# EAGLE design pico_test_synth1 (EAGLE 9.6.2)
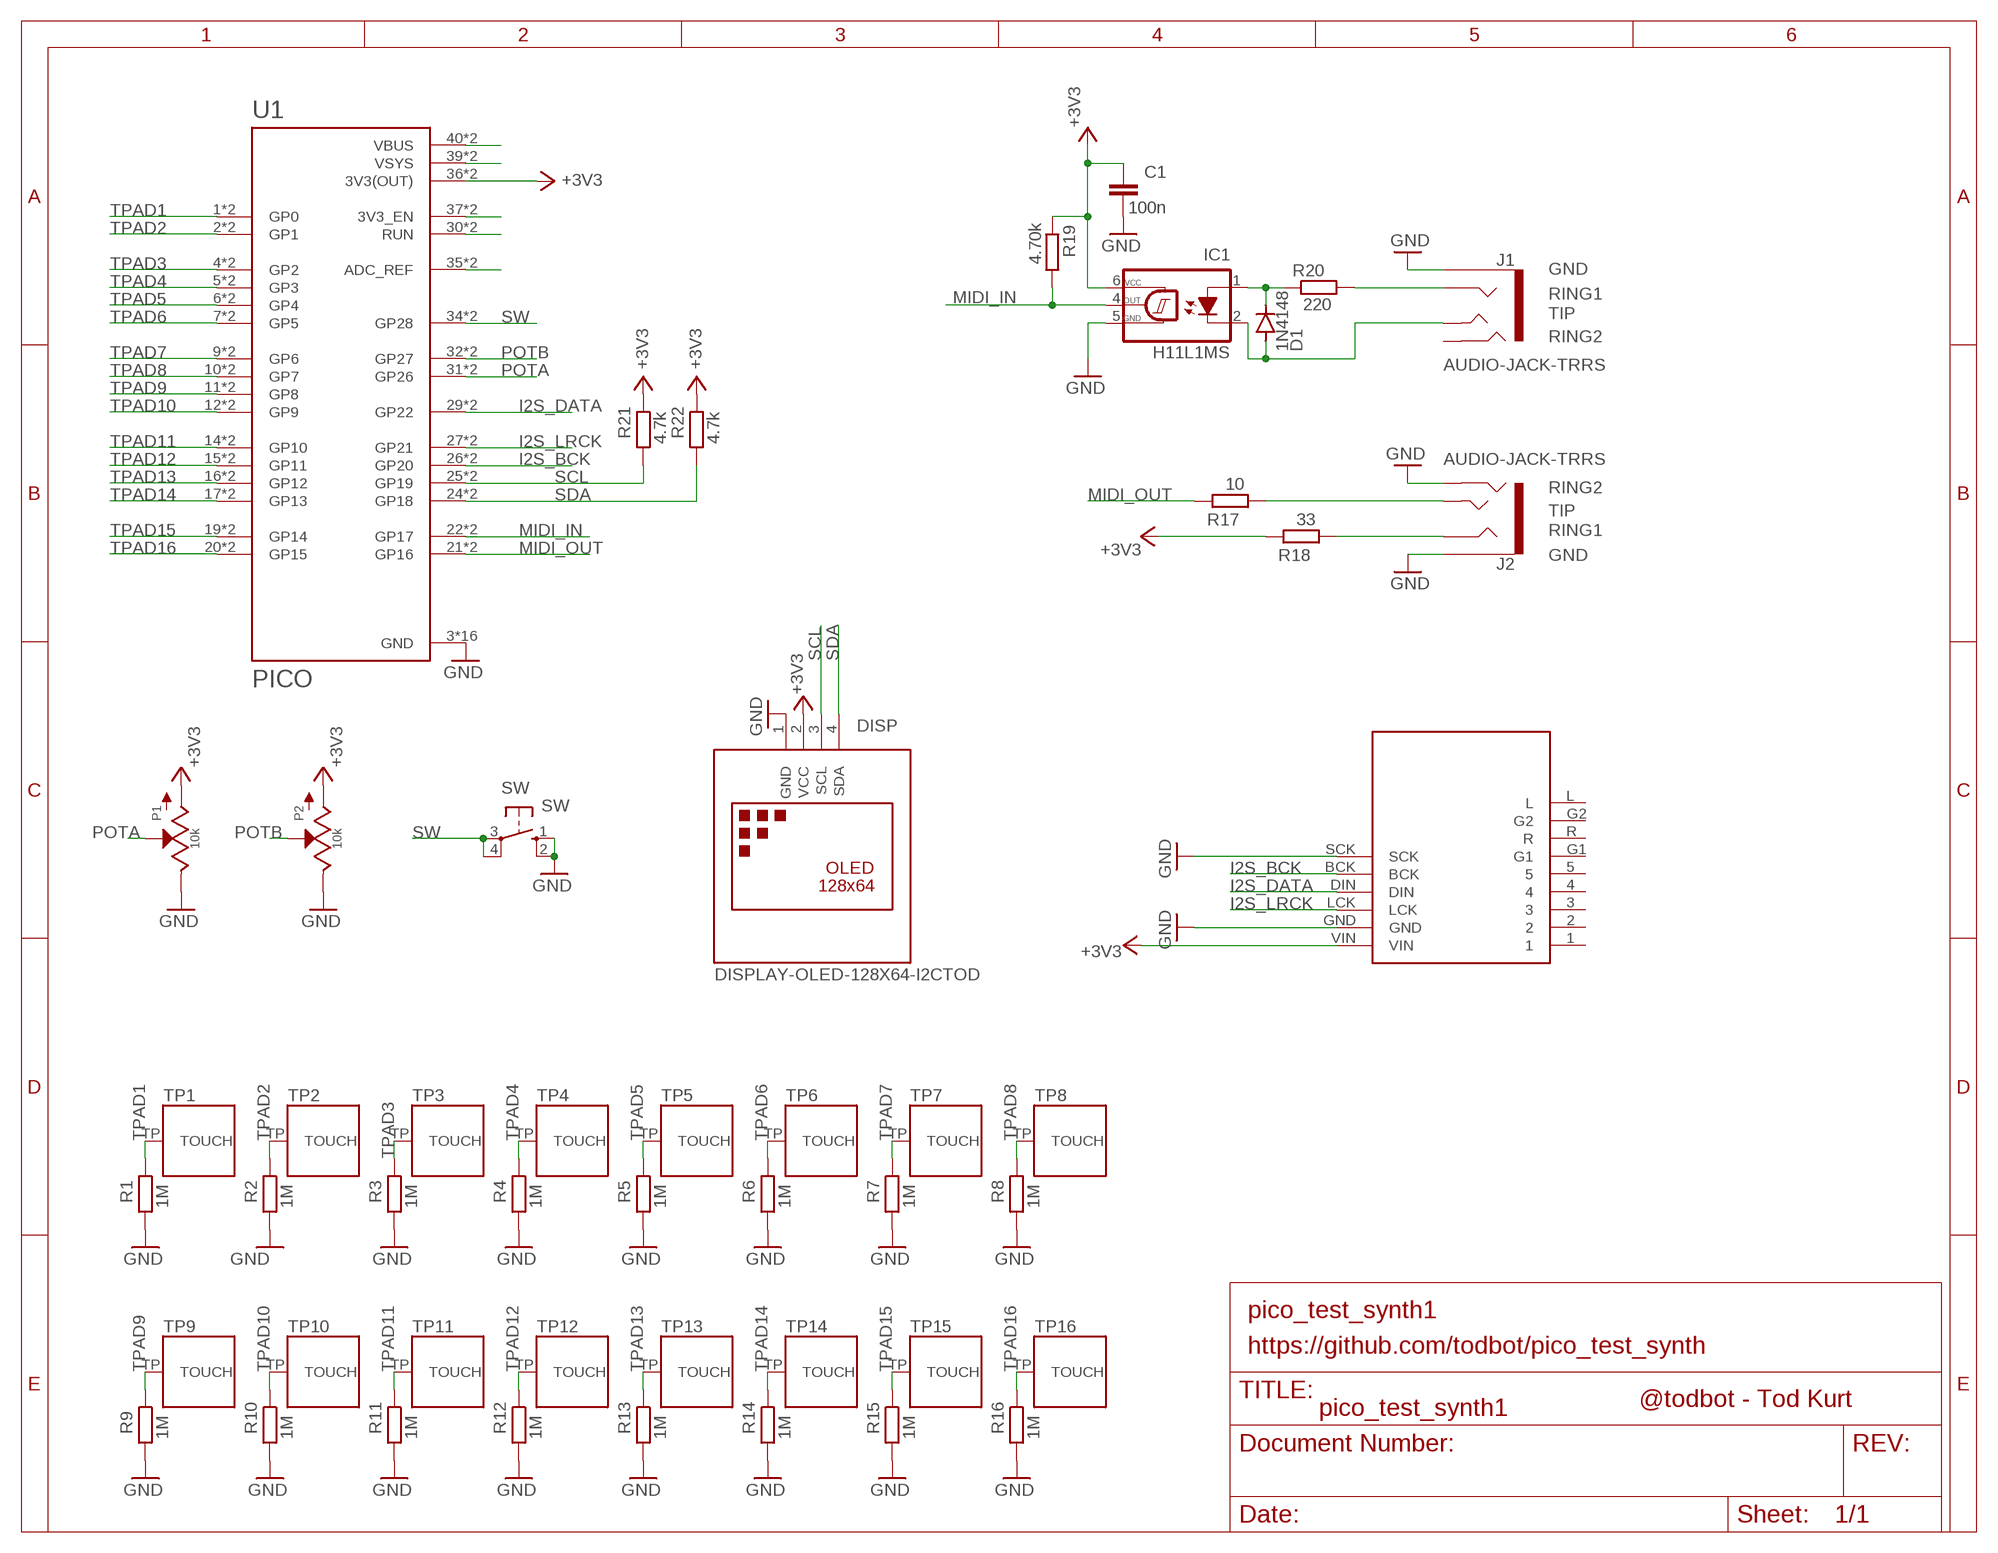
[diagram p0: schematic, sheet 1]

## Parts
C1  100n  C-EUC0805  [C0805]
D1  1N4148  DIODE-SOD123  [SOD123]
DISP  DISPLAY-OLED-128X64-I2CTOD  [DISPLAY-OLED-128X64-I2C-TOD]
IC1  H11L1MS  [DIL6-SMD]
J1  AUDIO-JACK-TRRS  [PJ-320D_SPARKFUN]
J2  AUDIO-JACK-TRRS  [PJ-320D_SPARKFUN]
P1  10k  POTZEPHPOT_BIGKNOB  [OG-POTS_ALPS_POT_VERTICAL_WITHBIGKNOB]
P2  10k  POTZEPHPOT_BIGKNOB  [OG-POTS_ALPS_POT_VERTICAL_WITHBIGKNOB]
R1  1M  R-EU_R0805  [R0805]
R2  1M  R-EU_R0805  [R0805]
R3  1M  R-EU_R0805  [R0805]
R4  1M  R-EU_R0805  [R0805]
R5  1M  R-EU_R0805  [R0805]
R6  1M  R-EU_R0805  [R0805]
R7  1M  R-EU_R0805  [R0805]
R8  1M  R-EU_R0805  [R0805]
R9  1M  R-EU_R0805  [R0805]
R10  1M  R-EU_R0805  [R0805]
R11  1M  R-EU_R0805  [R0805]
R12  1M  R-EU_R0805  [R0805]
R13  1M  R-EU_R0805  [R0805]
R14  1M  R-EU_R0805  [R0805]
R15  1M  R-EU_R0805  [R0805]
R16  1M  R-EU_R0805  [R0805]
R17  10  R-EU_R0805  [R0805]
R18  33  R-EU_R0805  [R0805]
R19  4.70k  R-EU_R0805  [R0805]
R20  220  R-EU_R0805  [R0805]
R21  4.7k  R-EU_R0805  [R0805]
R22  4.7k  R-EU_R0805  [R0805]
SW  SW  10-XX  [B3F-10XX]
TP1  TOUCHPADA  [TOUCHPADA_0.5IN]
TP2  TOUCHPADA  [TOUCHPADA_0.5IN]
TP3  TOUCHPADA  [TOUCHPADA_0.5IN]
TP4  TOUCHPADA  [TOUCHPADA_0.5IN]
TP5  TOUCHPADA  [TOUCHPADA_0.5IN]
TP6  TOUCHPADA  [TOUCHPADA_0.5IN]
TP7  TOUCHPADA  [TOUCHPADA_0.5IN]
TP8  TOUCHPADA  [TOUCHPADA_0.5IN]
TP9  TOUCHPADA  [TOUCHPADA_0.5IN]
TP10  TOUCHPADA  [TOUCHPADA_0.5IN]
TP11  TOUCHPADA  [TOUCHPADA_0.5IN]
TP12  TOUCHPADA  [TOUCHPADA_0.5IN]
TP13  TOUCHPADA  [TOUCHPADA_0.5IN]
TP14  TOUCHPADA  [TOUCHPADA_0.5IN]
TP15  TOUCHPADA  [TOUCHPADA_0.5IN]
TP16  TOUCHPADA  [TOUCHPADA_0.5IN]
U1  PICO  RASPBERRY_PICO-NO_DEBUG  [PICO-PKG-NO_DEBUG]
U2  I2S_PCM_51XX_SOUNDCARD  [I2S_PCM_5100_SOUNDCARD]

## Nets
+3V3: C1.1 DISP.2(VCC) IC1.6(VCC) P1.P$3(A) P2.P$3(A) R18.1 R19.1 R21.1 R22.1 U1.36(3V3(OUT)) U1.P$36(3V3(OUT)) U2.VIN
GND [power]: C1.2 DISP.1(GND) IC1.5(GND) J1.EARTH J2.EARTH J2.RING2 P1.P$1(E) P2.P$1(E) R1.2 R2.2 R3.2 R4.2 R5.2 R6.2 R7.2 R8.2 R9.2 R10.2 R11.2 R12.2 R13.2 R14.2 R15.2 R16.2 SW.1(S) SW.2(S1) U1.3(GND) U1.8(GND) U1.13(GND) U1.18(GND) U1.23(GND) U1.28(GND) U1.33(GND) U1.38(GND) U1.P$3(GND) U1.P$8(GND) U1.P$13(GND) U1.P$18(GND) U1.P$23(GND) U1.P$28(GND) U1.P$33(GND) U1.P$38(GND) U2.GND U2.SCK
I2S_BCK: U1.26(GP20) U1.P$26(GP20) U2.BCK
I2S_DATA: U1.29(GP22) U1.P$29(GP22) U2.DIN
I2S_LRCK: U1.27(GP21) U1.P$27(GP21) U2.LCK
MIDI_IN: IC1.4(OUT) R19.2 U1.22(GP17) U1.P$22(GP17)
MIDI_OUT: R17.1 U1.21(GP16) U1.P$21(GP16)
N$1: U1.35(ADC_REF) U1.P$35(ADC_REF)
N$2: J1.RING1 R20.2
N$3: U1.30(RUN) U1.P$30(RUN)
N$4: U1.37(3V3_EN) U1.P$37(3V3_EN)
N$5: U1.39(VSYS) U1.P$39(VSYS)
N$6: U1.40(VBUS) U1.P$40(VBUS)
N$13: D1.C IC1.1(A) R20.1
N$14: D1.A IC1.2(C) J1.TIP
N$20: J2.RING1 R18.2
N$21: J2.TIP R17.2
POTA: P1.P$2(S) U1.31(GP26) U1.P$31(GP26)
POTB: P2.P$2(S) U1.32(GP27) U1.P$32(GP27)
SCL: DISP.3(SCL) R21.2 U1.25(GP19) U1.P$25(GP19)
SDA: DISP.4(SDA) R22.2 U1.24(GP18) U1.P$24(GP18)
SW [power]: SW.3(P) SW.4(P1) U1.34(GP28) U1.P$34(GP28)
TPAD1: R1.1 TP1.TP(TOUCH) U1.1(GP0) U1.P$1(GP0)
TPAD2: R2.1 TP2.TP(TOUCH) U1.2(GP1) U1.P$2(GP1)
TPAD3: R3.1 TP3.TP(TOUCH) U1.4(GP2) U1.P$4(GP2)
TPAD4: R4.1 TP4.TP(TOUCH) U1.5(GP3) U1.P$5(GP3)
TPAD5: R5.1 TP5.TP(TOUCH) U1.6(GP4) U1.P$6(GP4)
TPAD6: R6.1 TP6.TP(TOUCH) U1.7(GP5) U1.P$7(GP5)
TPAD7: R7.1 TP7.TP(TOUCH) U1.9(GP6) U1.P$9(GP6)
TPAD8: R8.1 TP8.TP(TOUCH) U1.10(GP7) U1.P$10(GP7)
TPAD9: R9.1 TP9.TP(TOUCH) U1.11(GP8) U1.P$11(GP8)
TPAD10: R10.1 TP10.TP(TOUCH) U1.12(GP9) U1.P$12(GP9)
TPAD11: R11.1 TP11.TP(TOUCH) U1.14(GP10) U1.P$14(GP10)
TPAD12: R12.1 TP12.TP(TOUCH) U1.15(GP11) U1.P$15(GP11)
TPAD13: R13.1 TP13.TP(TOUCH) U1.16(GP12) U1.P$16(GP12)
TPAD14: R14.1 TP14.TP(TOUCH) U1.17(GP13) U1.P$17(GP13)
TPAD15: R15.1 TP15.TP(TOUCH) U1.19(GP14) U1.P$19(GP14)
TPAD16: R16.1 TP16.TP(TOUCH) U1.20(GP15) U1.P$20(GP15)
Unconnected: J1.RING2 U2.1 U2.2 U2.3 U2.4 U2.5 U2.G1 U2.G2 U2.L U2.R

## Notes on the sheet
- GND
- RING1
- TIP
- RING2
- RING2
- TIP
- RING1
- GND
- pico_test_synth1
- https://github.com/todbot/pico_test_synth
- @todbot - Tod Kurt

## Library data of the parts
C1 = rcl:C-EU: CAPACITOR, European symbol; SPICEPREFIX: C
D1 = diode:DIODE-: DIODE
DISP = todstuff2023:DISPLAY-OLED-128X64-I2C: 128x64 Dot Matrix OLED Module based on SSD1306 chip Variant with I2C interface More details available here: http://www.instructables.com/id/Monochrome-096-i2c-OLED-display-with-arduino-SSD13/ SSD1306 datasheet: https://cdn-shop.adafruit.com/datasheets/SSD1306.pdf Click here to find device on ebay.com <http://www.ebay.com/sch/oled+display+128x64+iic> Note: There are two variants: I2C and SPI. Search for the proper version.
IC1 = optocoupler:H11L*M: 6-Pin DIP Optocoupler Source: http://www.fairchildsemi.com/ds/H1/H11L2-M.pdf; LCSC: C78589; MPN2: H11L1S; OC_FARNELL: unknown; OC_NEWARK: unknown
J1 J2 = audio_jacks_todbot:AUDIO-JACK-TRRS; LCSC: C431535; MPN: PJ-320D
P1 P2 = EurorackModularParts:POT
R1-R22 = rcl:R-EU_: RESISTOR, European symbol; SPICEPREFIX: R
SW = switch-omron:10-XX: OMRON SWITCH; MPN: B3F-1000; OC_FARNELL: 176432; OC_NEWARK: 36M3542
TP1-TP16 = todstuff2023:TOUCHPAD
U1 = RpiPico:RASPBERRY_PICO-NO_DEBUG
U2 = PCM5102A:I2S_PCM_51XX_SOUNDCARD

## Net classes
1 power: width 0.305 mm
2 thickpower: width 0.406 mm

## Board
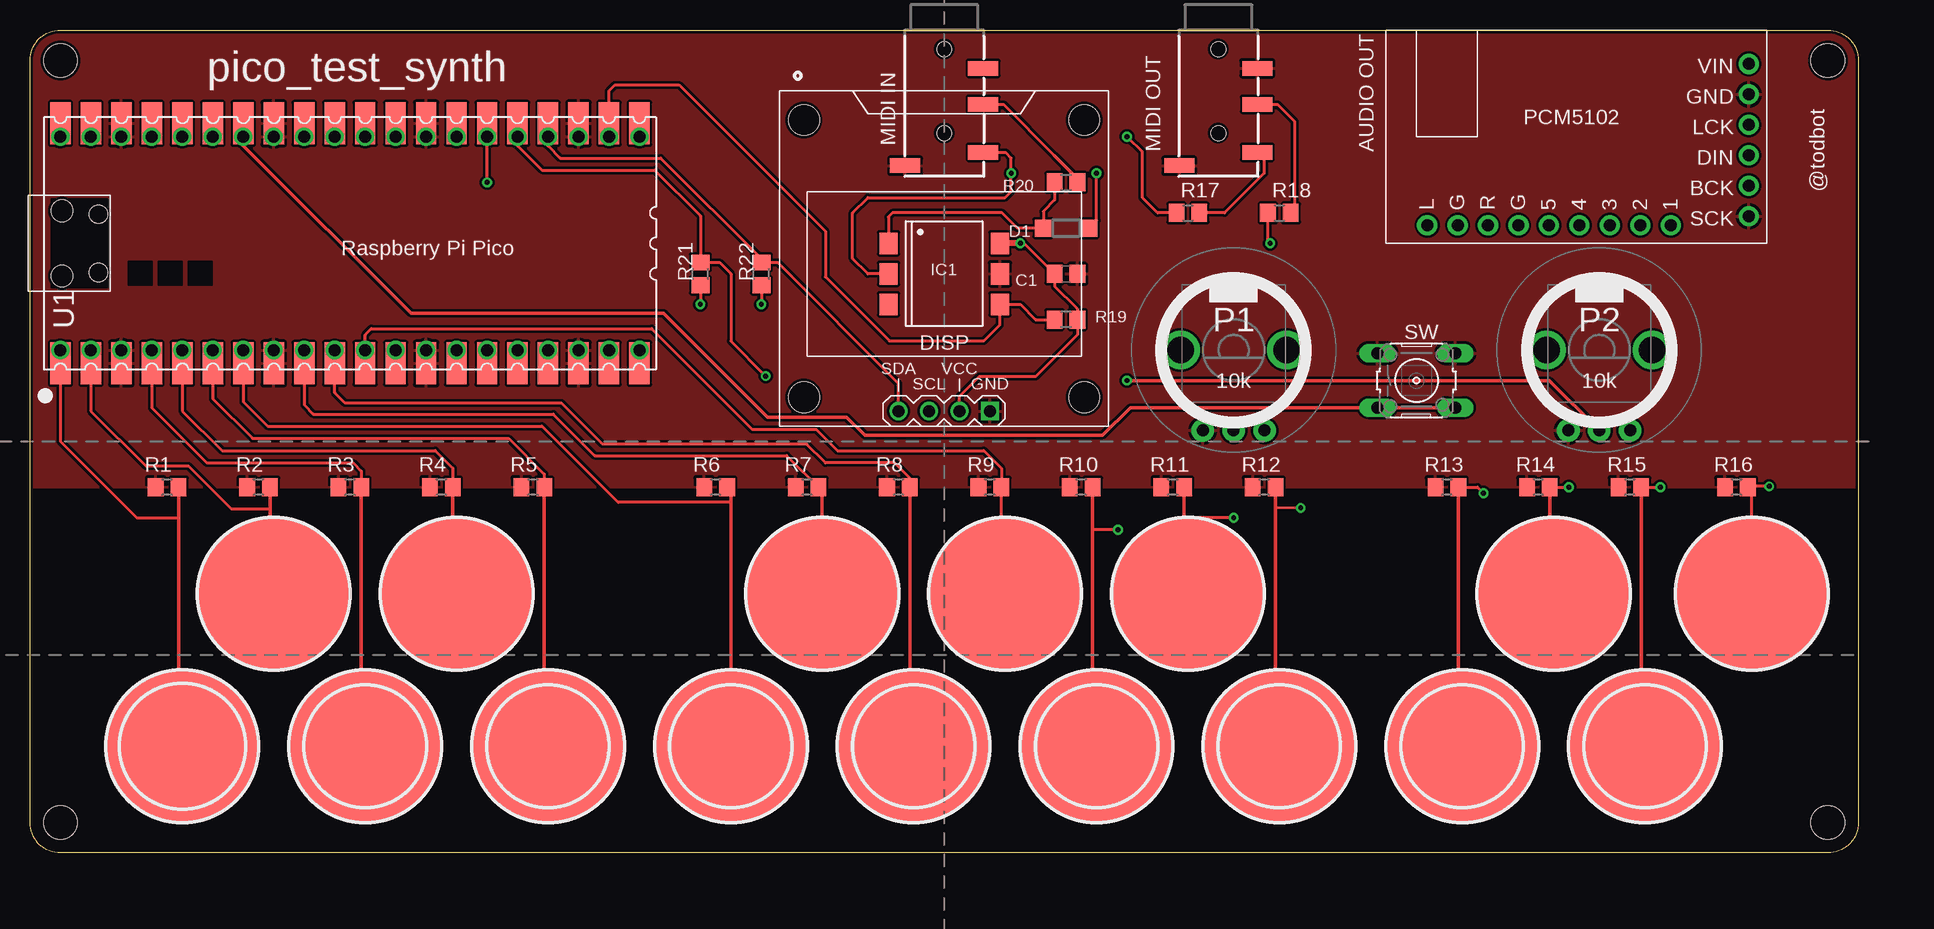
[diagram p1: board, top side]
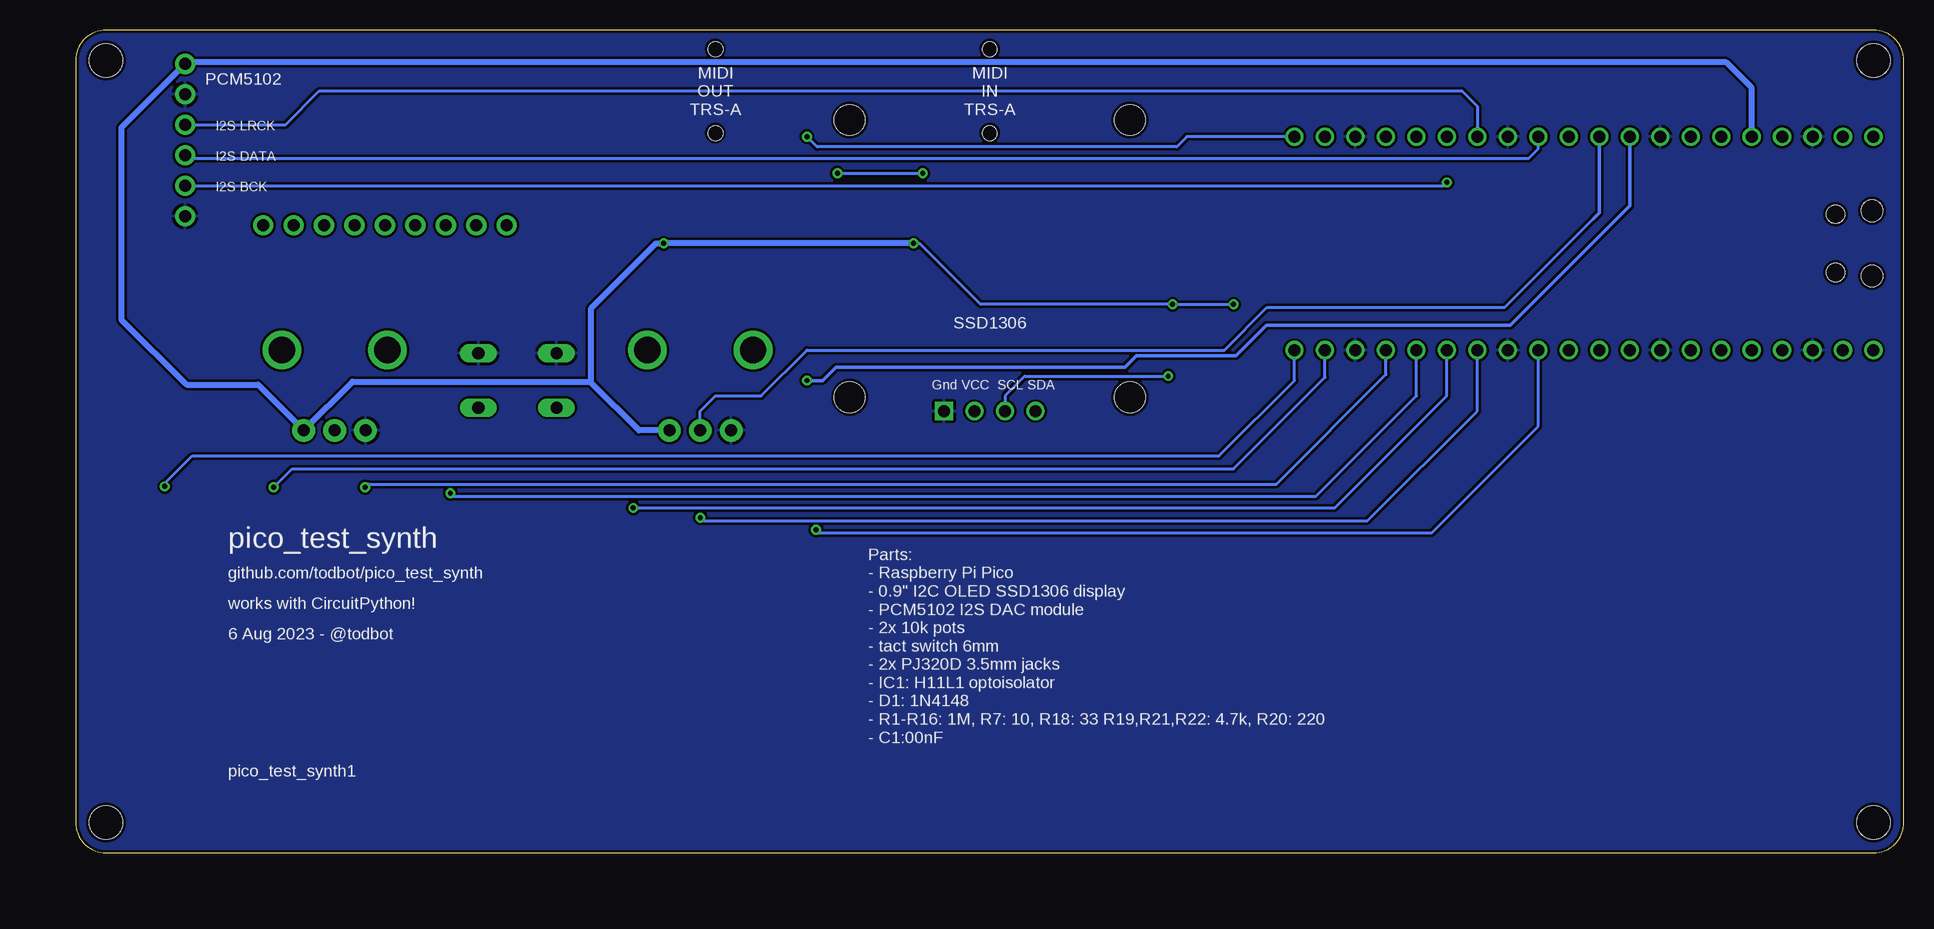
[diagram p2: board, bottom side, seen from below]

Size 152.4 x 68.58 mm. Coordinates in mm from the lower left corner, seen from the top.
Outline: 0,2.54 0,66.04 arc-90 2.54,68.58 149.86,68.58 arc-90 152.4,66.04 152.4,2.54 arc-90 149.86,0 2.54,0 arc-90 0,2.54
Copper layers (1*16): Top 0.035mm / dielectric 1.5mm / Bottom 0.035mm
Design rules "adafruit-rules-20180530 *": minimum track width 8mil, minimum drill 16mil, track to track 8mil, track to pad 8mil, pad to pad 8mil, via to via 8mil, smd to smd 8mil, copper to edge 10mil, drill to drill 8mil, minimum pad ring 10mil, minimum via ring 8mil, stop-mask expansion 4mil, vias tented up to drill 20mil, thermal gap 10mil
Holes 2.79 mm at 2.54,66.04 2.54,2.54 149.86,2.54 149.86,66.04

### Footprints (pad centres in the part's own frame; a part is rotated, then mirrored left to right if it is on the bottom)
C0805 = smd 1.3 x 1.5: 1 -0.95,0; 2 0.95,0
SOD123 = smd 1.4 x 1.4: A 1.9,0; C -1.9,0
DISPLAY-OLED-128X64-I2C-TOD = drill 1 square: 1 -3.81,12.7 | drill 1: 2 -1.27,12.7; 3 1.27,12.7; 4 3.81,12.7 | hole 2.54: -11.684,11.557; 11.684,11.557; 11.684,-11.557; -11.684,-11.557
DIL6-SMD = smd 1.78 x 1.52: 1 -2.54,-4.645; 2 0,-4.645; 3 2.54,-4.645; 4 2.54,4.645; 5 0,4.645; 6 -2.54,4.645
PJ-320D_SPARKFUN = smd 1.2 x 2.5: EARTH 11.3,-3.25; RING1 6.2,3.25; RING2 3.2,3.25; TIP 10.2,3.25 | hole 1.2: 1.6,0; 8.6,0
OG-POTS_ALPS_POT_VERTICAL_WITHBIGKNOB = drill 1 pad 1.88: P$1 -2.58,-6.7; P$2 0,-6.7; P$3 2.58,-6.7 | drill 2.2 pad 3.175: P$4 4.4,0; P$5 -4.4,0
R0805 = smd 1.3 x 1.5: 1 -0.95,0; 2 0.95,0
B3F-10XX = drill 1.016 long: 1 -3.251,2.261; 2 3.251,2.261; 3 -3.251,-2.261; 4 3.251,-2.261
TOUCHPADA_0.5IN = smd 12.7 x 12.7: TP 0,0
PICO-PKG-NO_DEBUG = drill 1: 1 -7.62,25.4; 2 -7.62,22.86; 3 -7.62,20.32; 4 -7.62,17.78; 5 -7.62,15.24; 6 -7.62,12.7; 7 -7.62,10.16; 8 -7.62,7.62; 9 -7.62,5.08; 10 -7.62,2.54; 11 -7.62,0; 12 -7.62,-2.54; 13 -7.62,-5.08; 14 -7.62,-7.62; 15 -7.62,-10.16; 16 -7.62,-12.7; 17 -7.62,-15.24; 18 -7.62,-17.78; 19 -7.62,-20.32; 20 -7.62,-22.86; 21 10.16,-22.86; 22 10.16,-20.32; 23 10.16,-17.78; 24 10.16,-15.24; 25 10.16,-12.7; 26 10.16,-10.16; 27 10.16,-7.62; 28 10.16,-5.08; 29 10.16,-2.54; 30 10.16,0; 31 10.16,2.54; 32 10.16,5.08; 33 10.16,7.62; 34 10.16,10.16; 35 10.16,12.7; 36 10.16,15.24; 37 10.16,17.78; 38 10.16,20.32; 39 10.16,22.86; 40 10.16,25.4 | smd 3.5 x 1.7: P$1 -8.73,25.4; P$2 -8.73,22.86; P$3 -8.73,20.32; P$4 -8.73,17.78; P$5 -8.73,15.24; P$6 -8.73,12.7; P$7 -8.73,10.16; P$8 -8.73,7.62; P$9 -8.73,5.08; P$10 -8.73,2.54; P$11 -8.73,0; P$12 -8.73,-2.54; P$13 -8.73,-5.08; P$14 -8.73,-7.62; P$15 -8.73,-10.16; P$16 -8.73,-12.7; P$17 -8.73,-15.24; P$18 -8.73,-17.78; P$19 -8.73,-20.32; P$20 -8.73,-22.86; P$21 11.27,-22.86; P$22 11.27,-20.32; P$23 11.27,-17.78; P$24 11.27,-15.24; P$25 11.27,-12.7; P$26 11.27,-10.16; P$27 11.27,-7.62; P$28 11.27,-5.08; P$29 11.27,-2.54; P$30 11.27,0; P$31 11.27,2.54; P$32 11.27,5.08; P$33 11.27,7.62; P$34 11.27,10.16; P$35 11.27,12.7; P$36 11.27,15.24; P$37 11.27,17.78; P$38 11.27,20.32; P$39 11.27,22.86; P$40 11.27,25.4 | hole 1.8: -1.455,25.27; 3.995,25.27 | hole 1.5: -1.155,22.24; 3.695,22.24
I2S_PCM_5100_SOUNDCARD = drill 1 pad 1.676: 1 1.5,8; 2 1.5,10.54; 3 1.5,13.08; 4 1.5,15.62; 5 1.5,18.16; BCK 4.79,1.5; DIN 7.33,1.5; G1 1.5,20.7; G2 1.5,25.78; GND 12.41,1.5; L 1.5,28.32; LCK 9.87,1.5; R 1.5,23.24; SCK 2.25,1.5; VIN 14.95,1.5

### Placement (x,y rotation side)
C1  86.36,48.26 0 top
D1  86.36,52.07 0 top
DISP  76.2,49.53 180 top
IC1  76.2,48.26 270 top
J1  76.2,68.58 270 top
J2  99.06,68.58 270 top
P1  100.33,41.91 0 top
P2  130.81,41.91 0 top
R1  11.43,30.48 180 top
R2  19.05,30.48 180 top
R3  26.67,30.48 180 top
R4  34.29,30.48 180 top
R5  41.91,30.48 180 top
R6  57.15,30.48 180 top
R7  64.77,30.48 180 top
R8  72.39,30.48 180 top
R9  80.01,30.48 180 top
R10  87.63,30.48 180 top
R11  95.25,30.48 180 top
R12  102.87,30.48 180 top
R13  118.11,30.48 180 top
R14  125.73,30.48 180 top
R15  133.35,30.48 180 top
R16  142.24,30.48 180 top
R17  96.52,53.34 0 top
R18  104.14,53.34 0 top
R19  86.36,44.45 180 top
R20  86.36,55.88 0 top
R21  55.88,48.26 90 top
R22  60.96,48.26 90 top
SW  115.57,39.37 0 top
TP1  12.7,8.89 0 top
TP2  20.32,21.59 0 top
TP3  27.94,8.89 0 top
TP4  35.56,21.59 0 top
TP5  43.18,8.89 0 top
TP6  58.42,8.89 0 top
TP7  66.04,21.59 0 top
TP8  73.66,8.89 0 top
TP9  81.28,21.59 0 top
TP10  88.9,8.89 0 top
TP11  96.52,21.59 0 top
TP12  104.14,8.89 0 top
TP13  119.38,8.89 0 top
TP14  127,21.59 0 top
TP15  134.62,8.89 0 top
TP16  143.51,21.59 0 top
U1  27.94,49.53 90 top
U2  144.78,50.8 90 top

### Tracks (layer width: path | path; a pad name or v marks a point on that pad's centre or on a via)
+3V3  (via drill 0.41)
  Top 0.254: v82.55,50.8 82.87,50.8 C1.1 85.41,47.24 87.31,45.34 R19.1 87.31,43.18 83.82,39.69 79.12,39.69 77.47,38.04 DISP.2 | R22.1 v60.96,45.72 | R21.1 v55.88,45.72 | U1.P$36 U1.36 | v103.38,50.8 103.19,50.99 R18.1
  Top 0.508: v82.55,50.8 IC1.6
  Bottom 0.254: v55.88,45.72 v60.96,45.72 76.96,45.72 82.04,50.8 v82.55,50.8
  Bottom 0.508: U1.36 12.7,63.75 14.82,65.87 143.16,65.87 U2.VIN 148.59,60.44 148.59,44.45 143.16,39.02 137.2,39.02 P2.P$3 129.33,39.27 109.51,39.27 109.42,39.17 | 109.42,39.17 105.45,35.21 P1.P$3 | 109.42,39.17 109.42,45.41 104.02,50.8 v103.38,50.8 v82.55,50.8
GND
  pour Bottom: 0,0 0,68.83 162.56,68.83 162.56,0
  pour Top: 0,68.58 153.67,68.58 153.67,30.48 0,30.48
I2S_BCK  (via drill 0.41)
  Top 0.254: v38.1,55.88 U1.26
  Top 0.305: U1.P$26 U1.26
  Bottom 0.254: U2.BCK 38.39,55.59 v38.1,55.88
I2S_DATA
  Top 0.305: U1.P$29 U1.29
  Bottom 0.254: U2.DIN 143.03,57.88 31.28,57.88 30.48,58.67 U1.29
I2S_LRCK
  Top 0.305: U1.P$27 U1.27
  Bottom 0.254: U2.LCK 134.91,60.67 132.08,63.5 36.83,63.5 35.56,62.23 U1.27
MIDI_IN
  Top 0.254: R19.2 83.82,44.45 82.55,45.72 IC1.4 80.84,44.02 79.5,42.67 71.63,42.67 66.29,48.01 66.29,51.82 54.1,64.01 48.77,64.01 48.26,63.5 U1.P$22
  Top 0.305: U1.P$22 U1.22
MIDI_OUT  (via drill 0.41)
  Top 0.254: v91.44,59.69 92.71,58.42 92.71,54.61 93.98,53.34 R17.1
  Top 0.305: U1.P$21 U1.21
  Bottom 0.254: U1.21 59.77,59.69 60.62,58.84 90.59,58.84 v91.44,59.69
N$1
  Top 0.254: U1.P$35 U1.35
N$2
  Top 0.254: J1.RING1 81.13,62.38 85.41,58.1
  Top 0.305: R20.2 87.31,56.2 85.41,58.1
N$3
  Top 0.254: U1.P$30 U1.30
N$4
  Top 0.254: U1.P$37 U1.37
N$5
  Top 0.254: U1.P$39 U1.39
N$6
  Top 0.254: U1.P$40 U1.40
N$13
  Top 0.254: R20.1 85.41,54.42 84.46,53.47 D1.C 82.3,52.07 81.03,53.34 71.88,53.34 71.56,53.01 IC1.1
N$14  (via drill 0.41)
  Top 0.254: J1.TIP 81.32,58.38 81.79,57.91 v81.79,56.64 81.79,55.12 81.28,54.61 69.85,54.61 68.58,53.34 68.58,49.53 69.85,48.26 IC1.2 | D1.A 88.9,52.71 v88.9,56.64
  Bottom 0.254: v88.9,56.64 v81.79,56.64
N$20
  Top 0.254: J2.RING1 103.99,62.38 105.41,60.96 105.41,53.66 R18.2
N$21
  Top 0.254: J2.TIP 102.87,57.82 102.87,56.64 99.57,53.34 R17.2
POTA
  Top 0.305: U1.P$31 U1.31
  Bottom 0.254: 25.91,52.83 33.27,45.47 53.09,45.47 56.64,41.91 91.44,41.91 95.25,38.1 99.06,38.1 100.33,36.83 P1.P$2
  Bottom 0.305: 25.91,52.83 25.4,53.34 U1.31
POTB  (via drill 0.41)
  Top 0.305: P2.P$2 126.65,39.37 v91.44,39.37 | U1.P$32 U1.32
  Bottom 0.305: v91.44,39.37 90.13,39.37 89.02,40.48 64.94,40.48 63.98,41.43 55.68,41.43 53.14,43.97 32.82,43.97 22.86,53.93 U1.32
SCL  (via drill 0.41)
  Top 0.254: U1.25 40.64,58.93 42.67,56.9 52.07,56.9 55.88,53.09 R21.2 57.47,49.21 58.42,48.26 58.42,42.65 v61.33,39.74
  Top 0.305: U1.P$25 U1.25
  Bottom 0.254: v61.33,39.74 73.29,39.74 74.93,38.1 DISP.3
SDA
  Top 0.254: U1.24 43.18,58.93 44.2,57.91 52.58,57.91 60.96,49.53 R22.2 62.3,49.21 72.39,39.12 DISP.4
  Top 0.305: U1.P$24 U1.24
SW
  Top 0.305: SW.4 SW.3 91.72,37.11 89.41,34.8 69.6,34.8 68.07,36.32 65.24,36.32 65.21,36.3 61.49,36.3 52.83,44.96 31.75,44.96 17.78,58.93 U1.34 U1.P$34
TPAD1
  Top 0.254: 12.38,27.94 8.89,27.94 4.57,32.26 4.45,32.38 2.54,34.29 U1.P$1 U1.1
  Top 0.305: TP1.TP 12.38,9.21 12.38,27.94 R1.1
TPAD2
  Top 0.254: 20,28.7 16.76,28.7 13.21,32.26 9.65,32.26 5.08,36.83 U1.P$2 U1.2
  Top 0.305: TP2.TP 20,21.91 20,28.7 R2.1
TPAD3
  Top 0.254: R3.1 27.62,31.82 26.92,32.51 14.73,32.51 10.16,37.08 U1.P$4 U1.4
  Top 0.305: TP3.TP 27.62,9.21 R3.1
TPAD4
  Top 0.254: R4.1 35.24,32.07 33.78,33.53 16,33.53 12.7,36.83 U1.P$5 U1.5
  Top 0.305: TP4.TP 35.24,21.91 R4.1
TPAD5
  Top 0.254: R5.1 42.86,31.56 39.88,34.54 18.54,34.54 15.24,37.85 U1.P$6 U1.6
  Top 0.305: TP5.TP 42.86,9.21 R5.1
TPAD6
  Top 0.254: 58.42,29.21 49.02,29.21 42.67,35.56 19.81,35.56 17.78,37.59 U1.P$7 U1.7
  Top 0.305: TP6.TP 58.42,29.21 58.42,30.16 R6.1
TPAD7
  Top 0.254: U1.P$9 22.86,37.34 23.62,36.58 43.62,36.58 47.08,33.12 63.08,33.12 65.88,30.32
  Top 0.305: TP7.TP 66.04,30.16 65.88,30.32 R7.1 | U1.P$9 U1.9
TPAD8
  Top 0.254: U1.10 25.4,38.35 26.26,37.49 44.3,37.49 47.73,34.06 64.75,34.06 66.29,32.51 72.07,32.51 73.34,31.24 R8.1
  Top 0.305: TP8.TP 73.34,9.21 R8.1 | U1.P$10 U1.10
TPAD9
  Top 0.254: 80.96,21.91 R9.1 80.96,32.07 79.5,33.53 67.31,33.53 65.53,35.31 60.2,35.31 51.82,43.69 28.45,43.69 27.94,43.18 U1.11
  Top 0.305: TP9.TP 80.96,21.91 | U1.P$11 U1.11
TPAD10  (via drill 0.41)
  Top 0.254: v90.68,26.92 88.58,26.92 R10.1
  Top 0.305: TP10.TP 88.58,9.21 R10.1 | U1.P$12 U1.12
  Bottom 0.254: v90.68,26.92 90.42,26.67 39.37,26.67 30.48,35.56 U1.12
TPAD11  (via drill 0.41)
  Top 0.254: v100.33,27.94 96.2,27.94 R11.1
  Top 0.305: TP11.TP 96.2,21.91 R11.1 | U1.P$14 U1.14
  Bottom 0.254: v100.33,27.94 100.08,27.69 44.7,27.69 35.56,36.83 U1.14
TPAD12  (via drill 0.41)
  Top 0.203: R12.1 103.82,28.75 v105.92,28.75
  Top 0.305: TP12.TP 103.82,9.21 R12.1 | U1.P$15 U1.15
  Bottom 0.254: v105.92,28.75 47.45,28.75 38.1,38.1 U1.15
TPAD13  (via drill 0.41)
  Top 0.254: R13.1 120.65,30.48 v121.16,29.97
  Top 0.305: TP13.TP 119.06,9.21 R13.1 | U1.P$16 U1.16
  Bottom 0.254: v121.16,29.97 120.9,29.72 49.02,29.72 40.64,38.1 U1.16
TPAD14  (via drill 0.41)
  Top 0.254: R14.1 v128.27,30.48
  Top 0.305: TP14.TP 126.68,21.91 R14.1 | U1.P$17 U1.17
  Bottom 0.254: v128.27,30.48 128.02,30.73 52.32,30.73 43.18,39.88 U1.17
TPAD15  (via drill 0.41)
  Top 0.254: R15.1 v135.89,30.48
  Top 0.305: TP15.TP 134.3,9.21 R15.1 | U1.P$19 U1.19
  Bottom 0.254: v135.89,30.48 134.37,32 55.88,32 48.26,39.62 U1.19
TPAD16  (via drill 0.41)
  Top 0.203: R16.1 143.26,30.55
  Top 0.254: TP16.TP 143.51,30.16 | v144.97,30.55 143.26,30.55
  Top 0.305: 143.51,30.16 R16.1 | U1.P$20 U1.20
  Bottom 0.203: v144.97,30.55 144.97,30.8
  Bottom 0.254: 144.97,30.8 142.68,33.09 57.08,33.09 50.8,39.37 U1.20

### Text on the board
tPlace: pico_test_synth | PCM5102 | MIDI IN | MIDI OUT | AUDIO OUT | @todbot | Raspberry Pi Pico
bPlace: PCM5102 | MIDI / IN / TRS-A | MIDI / OUT / TRS-A | I2S LRCK | I2S DATA | I2S BCK | SSD1306 | Gnd VCC SCL SDA | Parts: / - Raspberry Pi Pico / - 0.9" I2C OLED SSD1306 display / - PCM5102 I2S DAC module / - 2x 10k pots / - tact switch 6mm / - 2x PJ320D 3.5mm jacks / - IC1: H11L1 optoisolator / - D1: 1N4148 / - R1-R16: 1M, R7: 10, R18: 33 R19,R21,R22: 4.7k, R20: 220 / - C1:00nF | pico_test_synth | github.com/todbot/pico_test_synth | works with CircuitPython! | 6 Aug 2023 - @todbot | pico_test_synth1
Pinguin_tBackup: 5V | A0 | A1 | G | 3V | S | A2 | - | A3 | MO | + | MI | SDA | SCK | SCL | RX | Sig | TX | NeoPixel BFF
Pinguin_bBackup: USB | NeoPixel Driver / Neo+ <-> 5V / QT Py. Solder / back to back / Signal on A3